# EAGLE design Liion-Tester (EAGLE 9.6.2)
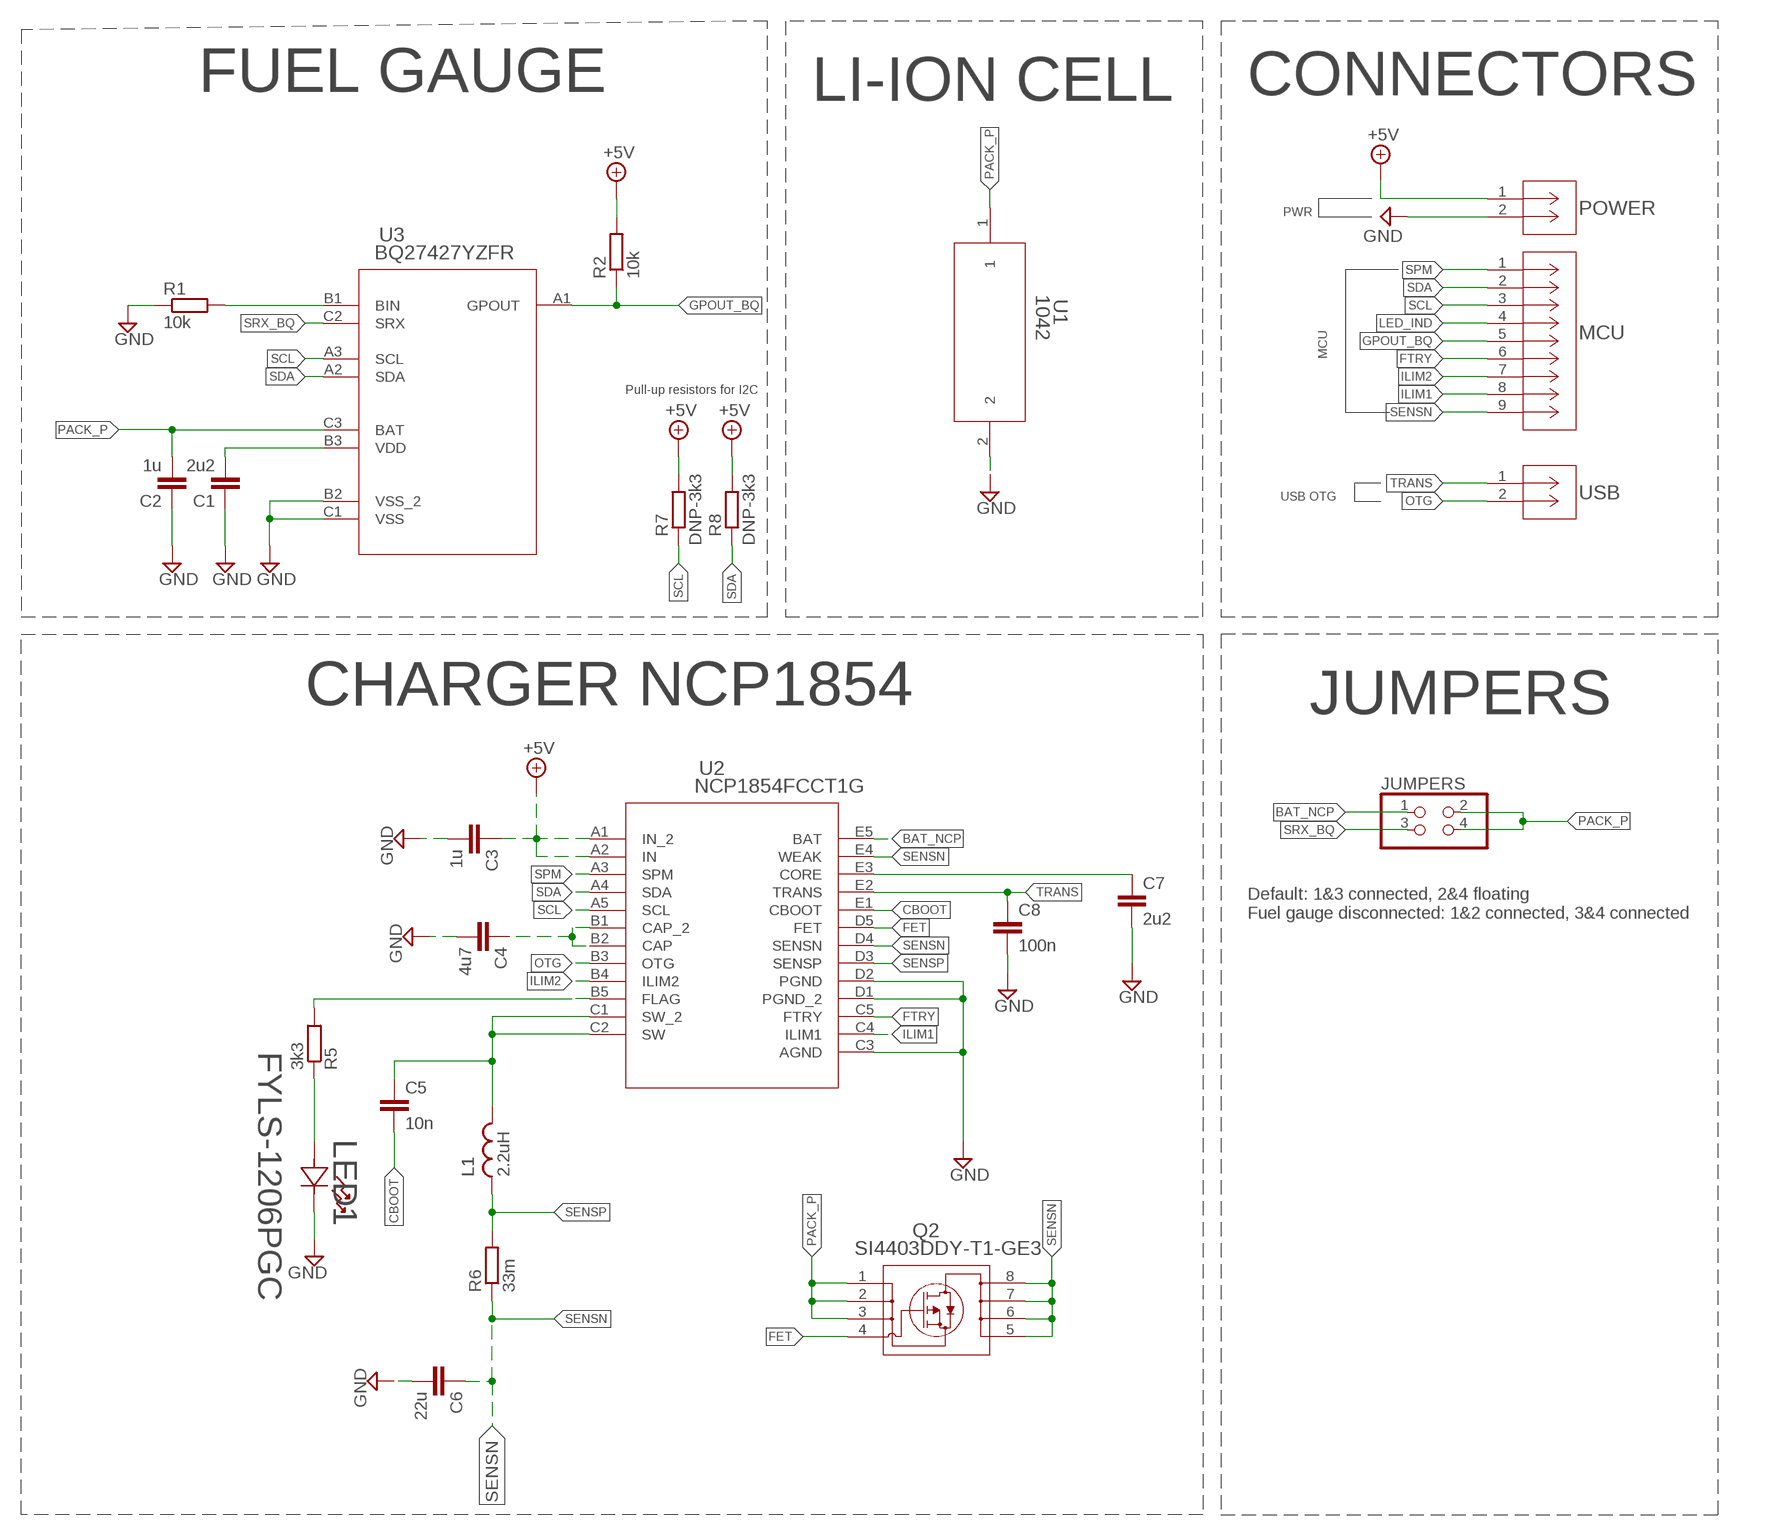
[diagram p0: schematic, sheet 1]

## Parts
C1  2u2  C-EUC0603  [C0603]
C2  1u  C-EUC0603  [C0603]
C3  1u  C-EUC0603  [C0603]
C4  4u7  C-EUC0603  [C0603]
C5  10n  C-EUC0603  [C0603]
C6  22u  C-EUC0603  [C0603]
C7  2u2  C-EUC0603  [C0603]
C8  100n  C-EUC0603  [C0603]
JUMPERS  PINHD-2X2  [2X02]
L1  2.2uH  SPM3012T-2R2M-LR  [SPM3012T-2R2M-LR]
LED1  FYLS-1206PGC  QBLP650-IW  [LED_QBLP650_1206_QTB]
MCU  250-109  [CONN_250-109_WAG]
POWER  250-102  [CONN_250-102_WAG]
Q2  SI4403DDY-T1-GE3  [SO-8_MS-012_VIS]
R1  10k  R-EU_R0603  [R0603]
R2  10k  R-EU_R0603  [R0603]
R5  3k3  R-EU_R0603  [R0603]
R6  33m  R-EU_R2512  [R2512]
R7  DNP-3k3  R-EU_R0603  [R0603]
R8  DNP-3k3  R-EU_R0603  [R0603]
U1  1042  [1042_KEY]
U2  NCP1854FCCT1G  [BGA25_2P55X2P2_ONS]
U3  BQ27427YZFR  [DSBGA9-YZF_TEX]
USB  250-102  [CONN_250-102_WAG]

## Nets
+5V: C3.1 POWER.1 R2.2 R7.2 R8.2 U2.A1(IN_2) U2.A2(IN)
BAT_NCP: JUMPERS.1 U2.E5(BAT)
CBOOT: C5.2 U2.E1(CBOOT)
FET: Q2.4 U2.D5(FET)
FTRY: MCU.6 U2.C5(FTRY)
GND: C1.1 C2.1 C3.2 C4.2 C6.2 C7.2 C8.2 LED1.1(CATHODE) POWER.2 R1.1 U1.2 U2.C3(AGND) U2.D1(PGND_2) U2.D2(PGND) U3.B2(VSS_2) U3.C1(VSS)
GPOUT_BQ: MCU.5 R2.1 U3.A1(GPOUT)
ILIM1: MCU.8 U2.C4(ILIM1)
ILIM2: MCU.7 U2.B4(ILIM2)
LED_IND: MCU.4 R5.2 U2.B5(FLAG)
N$1: C1.2 U3.B3(VDD)
N$2: R1.2 U3.B1(BIN)
N$3: C4.1 U2.B1(CAP_2) U2.B2(CAP)
N$4: LED1.2(ANODE) R5.1
N$7: C5.1 L1.P$2 U2.C1(SW_2) U2.C2(SW)
N$8: C7.1 U2.E3(CORE)
OTG: U2.B3(OTG) USB.2
PACK_P: C2.2 JUMPERS.2 JUMPERS.4 Q2.1 Q2.2 Q2.3 U1.1 U3.C3(BAT)
SCL: MCU.3 R7.1 U2.A5(SCL) U3.A3(SCL)
SDA: MCU.2 R8.1 U2.A4(SDA) U3.A2(SDA)
SENSN: C6.1 MCU.9 Q2.5 Q2.6 Q2.7 Q2.8 R6.1 U2.D4(SENSN) U2.E4(WEAK)
SENSP: L1.P$1 R6.2 U2.D3(SENSP)
SPM: MCU.1 U2.A3(SPM)
SRX_BQ: JUMPERS.3 U3.C2(SRX)
TRANS: C8.1 U2.E2(TRANS) USB.1

## Notes on the sheet
- FUEL GAUGE | LI-ION CELL
- CONNECTORS
- PWR
- MCU
- Pull-up resistors for I2C
- USB OTG
- CHARGER NCP1854 | JUMPERS
- Default: 1&3 connected, 2&4 floating
  Fuel gauge disconnected: 1&2 connected, 3&4 connected

## Library data of the parts
C1-C8 = rcl:C-EU: CAPACITOR, European symbol; SPICEPREFIX: C
JUMPERS = pinhead:PINHD-2X2: PIN HEADER
L1 = custom_library:SPM3012T-2R2M-LR
LED1 = custom_library:QBLP650-IW; COPYRIGHT: Copyright (C) 2024 Ultra Librarian. All rights reserved.; MANUFACTURER_PART_NUMBER: QBLP650-IW; MFR_NAME: QT Brightek; TYPE: LED Indication
MCU = custom_library:250-109; COPYRIGHT: Copyright (C) 2024 Ultra Librarian. All rights reserved.; MANUFACTURER_PART_NUMBER: 250-109; MFR_NAME: Wago
POWER USB = custom_library:250-102; COPYRIGHT: Copyright (C) 2024 Ultra Librarian. All rights reserved.; MANUFACTURER_PART_NUMBER: 250-102; MFR_NAME: Wago
Q2 = custom_library:SI4403DDY-T1-GE3; COPYRIGHT: Copyright (C) 2024 Ultra Librarian. All rights reserved.; MANUFACTURER_PART_NUMBER: SI4403DDY-T1-GE3; MFR_NAME: Vishay; TYPE: Transistors
R1 R2 R5-R8 = rcl:R-EU_: RESISTOR, European symbol; SPICEPREFIX: R
U1 = custom_library:1042; COPYRIGHT: Copyright (C) 2024 Ultra Librarian. All rights reserved.; MANUFACTURER_PART_NUMBER: 1042; MFR_NAME: Keystone Electronics
U2 = custom_library:NCP1854FCCT1G; COPYRIGHT: Copyright (C) 2024 Ultra Librarian. All rights reserved.; MANUFACTURER_PART_NUMBER: NCP1854FCCT1G; MFR_NAME: onsemi
U3 = custom_library:BQ27427YZFR; COPYRIGHT: Copyright (C) 2024 Ultra Librarian. All rights reserved.; MANUFACTURER_PART_NUMBER: BQ27427YZFR; MFR_NAME: Texas Instruments

## Board
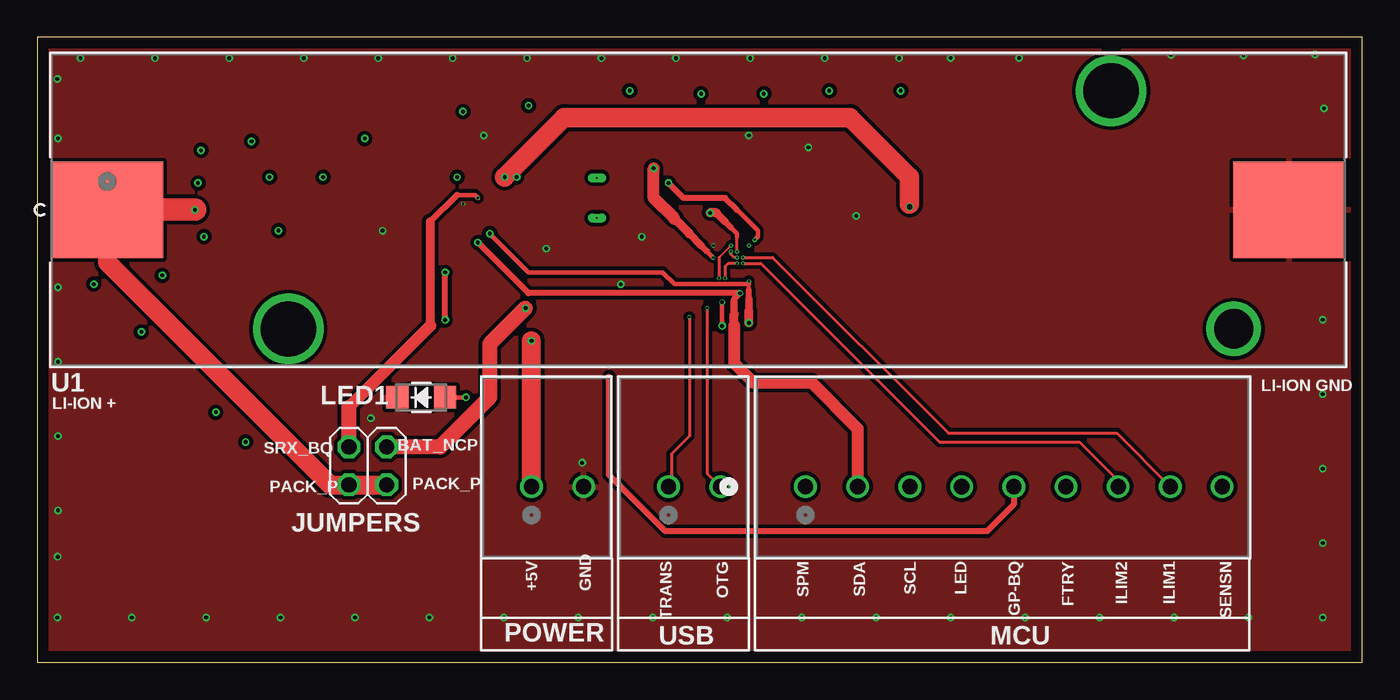
[diagram p1: board, top side]
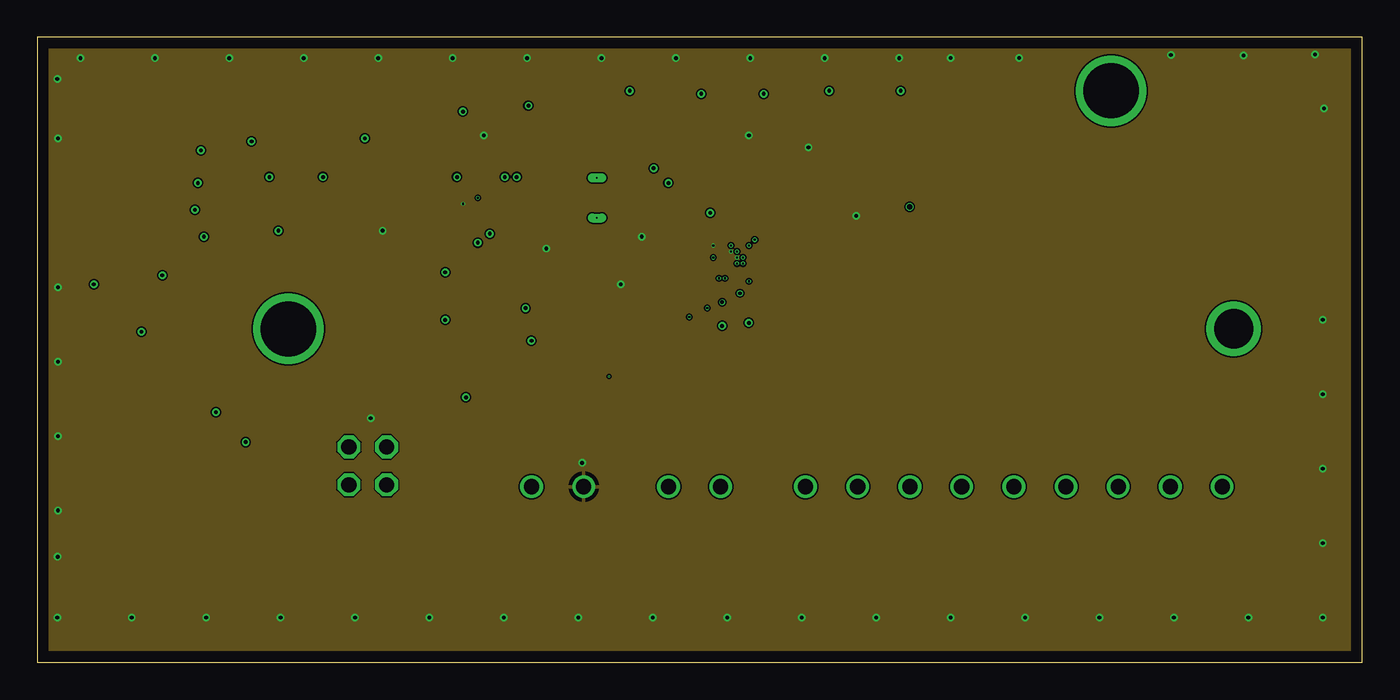
[diagram p2: board, inner layer Route2]
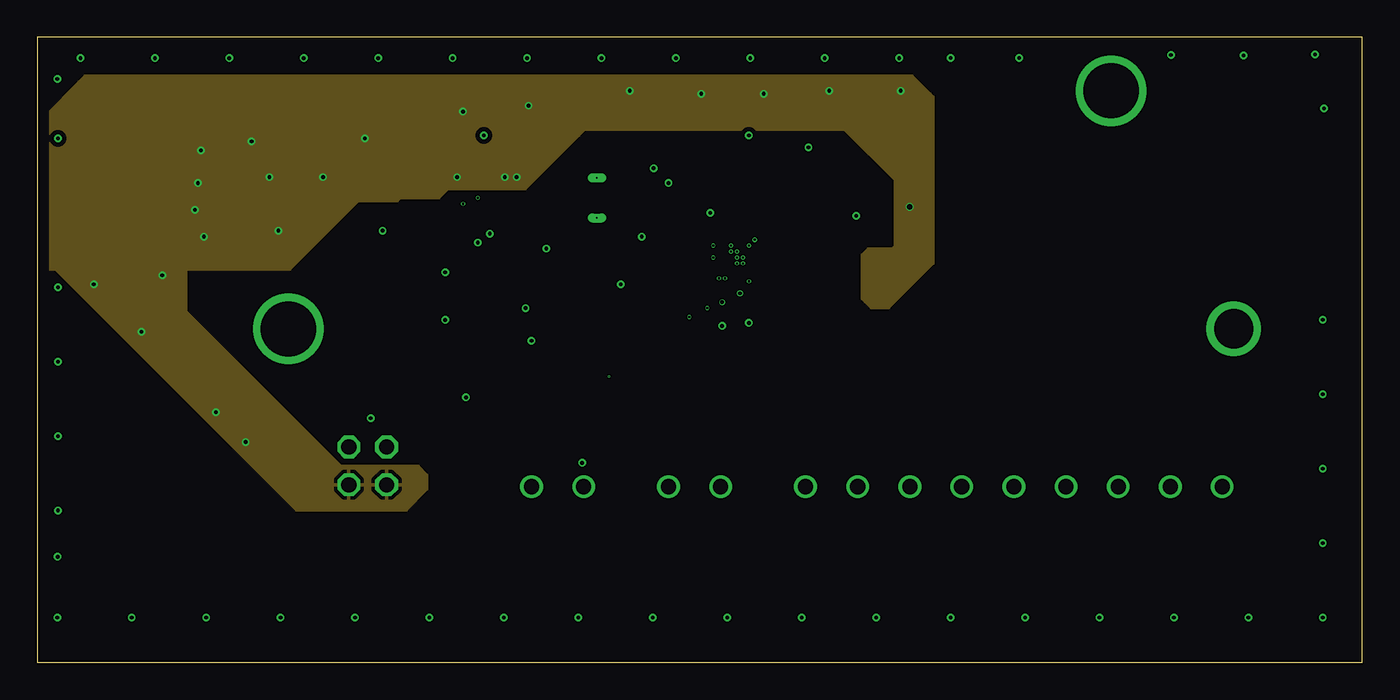
[diagram p3: board, inner layer Route15]
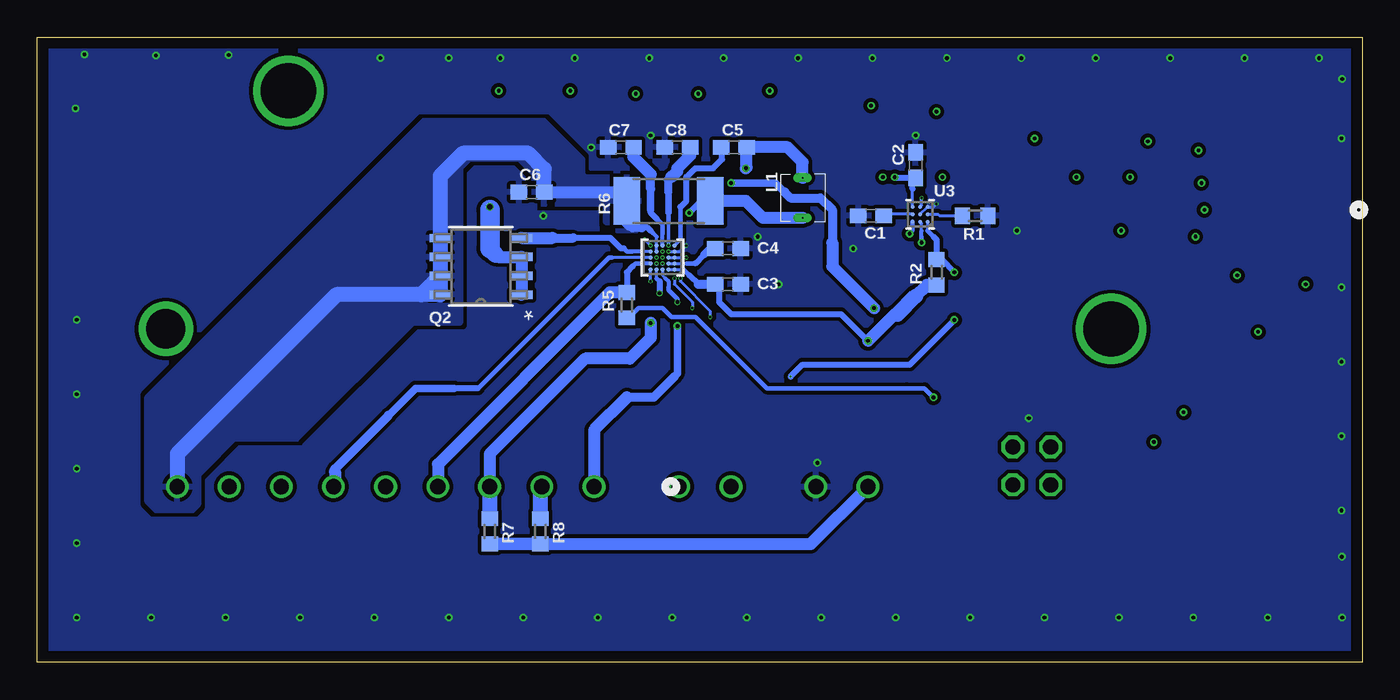
[diagram p4: board, bottom side, seen from below]

Size 89 x 42 mm. Coordinates in mm from the lower left corner, seen from the top.
Outline: 0,0 89,0 89,42 0,42 0,0
Copper layers (1+2*15+16): Top 0.035mm / dielectric 1.5mm / Route2 0.035mm / dielectric 0.15mm / Route15 0.035mm / dielectric 0.2mm / Bottom 0.035mm
Design rules "default *": minimum track width 4mil, minimum drill 0.04mm, track to track 4mil, track to pad 4mil, pad to pad 3mil, via to via 3mil, smd to smd 4mil, copper to edge 30mil, drill to drill 3mil, minimum pad ring 10mil, minimum via ring 2mil, stop-mask expansion 4mil, vias tented up to drill 250mil, thermal gap 10mil

### Footprints (pad centres in the part's own frame; a part is rotated, then mirrored left to right if it is on the bottom)
C0603 = smd 1.1 x 1: 1 -0.85,0; 2 0.85,0
2X02 = drill 1.016 octagon: 1 -1.27,-1.27; 2 -1.27,1.27; 3 1.27,-1.27; 4 1.27,1.27
SPM3012T-2R2M-LR = drill 0.1 long: P$1 -1.35,0; P$2 1.35,0
LED_QBLP650_1206_QTB = smd 1.5 x 1.499: 1 -1.6,0; 2 1.6,0
CONN_250-109_WAG = drill 1.016 pad 1.524: 1 0,0; 2 3.505,0; 3 7.01,0; 4 10.49,0; 5 13.995,0; 6 17.501,0; 7 21.006,0; 8 24.511,0; 9 27.991,0
CONN_250-102_WAG = drill 1.016 pad 1.524: 1 0,0; 2 3.505,0
SO-8_MS-012_VIS = smd 1.46 x 0.559: 1 -2.724,1.905; 2 -2.724,0.635; 3 -2.724,-0.635; 4 -2.724,-1.905; 5 2.724,-1.905; 6 2.724,-0.635; 7 2.724,0.635; 8 2.724,1.905
R0603 = smd 1 x 1.1: 1 -0.85,0; 2 0.85,0
R2512 = smd 1.8 x 3.2: 1 -2.8,0; 2 2.8,0
1042_KEY = smd 7.468 x 6.477: 1 -39.688,0; 2 39.688,0 | drill 3.708 pad 3.708: 3 27.737,8.001; 5 -27.534,-8.001 | drill 2.642 pad 2.642: 4 35.966,-8.001
BGA25_2P55X2P2_ONS = smd 0.305 x 0.305: A1 -0.8,0.8; A2 -0.4,0.8; A3 0,0.8; A4 0.4,0.8; A5 0.8,0.8; B1 -0.8,0.4; B2 -0.4,0.4; B3 0,0.4; B4 0.4,0.4; B5 0.8,0.4; C1 -0.8,0; C2 -0.4,0; C3 0,0; C4 0.4,0; C5 0.8,0; D1 -0.8,-0.4; D2 -0.4,-0.4; D3 0,-0.4; D4 0.4,-0.4; D5 0.8,-0.4; E1 -0.8,-0.8; E2 -0.4,-0.8; E3 0,-0.8; E4 0.4,-0.8; E5 0.8,-0.8
DSBGA9-YZF_TEX = smd 0.284 x 0.284: A1 -0.5,0.5; A2 0,0.5; A3 0.5,0.5; B1 -0.5,0; B2 0,0; B3 0.5,0; C1 -0.5,-0.5; C2 0,-0.5; C3 0.5,-0.5

### Placement (x,y rotation side)
C1  33,30 0 bottom
C2  30,33.4 270 bottom
C3  42.6,25.4 0 bottom
C4  42.6,27.8 0 bottom
C5  42.2,34.6 180 bottom
C6  55.8,31.6 180 bottom
C7  49.8,34.6 180 bottom
C8  46,34.6 180 bottom
JUMPERS  22.2,13.2 180 top
L1  37.6,31.2 90 bottom
LED1  25.8,17.8 0 top
MCU  51.6,11.8 0 top
POWER  33.2,11.8 0 top
Q2  59.2,26.6 180 bottom
R1  26,30 180 bottom
R2  28.6,26.2 270 bottom
R5  49.4,24 90 bottom
R6  46.6,31 0 bottom
R7  58.6,8.8 270 bottom
R8  55.2,8.8 270 bottom
U1  44.4,30.4 0 top
U2  47,27.2 180 bottom
U3  29.7,30.1 180 bottom
USB  42.4,11.8 0 top

### Tracks (layer width: path | path; a pad name or v marks a point on that pad's centre or on a via)
+5V  (via drill 0.25 pad 0.5)
  Top 1.27: POWER.1 v33.2,21.6
  Bottom 0.203: U2.A2 U2.A1 45.6,26.4
  Bottom 0.305: 45.6,26.4 45.2,26
  Bottom 0.4: C3.1 43.2,25.15 43.2,24.2 42.4,23.4 35,23.4 v33.2,21.6
  Bottom 0.406: 45.2,26 44.6,25.4
  Bottom 0.61: 44.6,25.4 C3.1
  Bottom 0.8: v33.2,21.6 31.4,23.4 31.2,23.4
  Bottom 0.813: 30,24.6 29.25,25.35 R2.2 | R8.2 R7.2 37.05,7.95 POWER.1
  Bottom 1.016: 31.2,23.4 30,24.6
BAT_NCP  (via drill 0.15 pad 0.25, 0.15 pad 0.3, 0.25 pad 0.5)
  Top 0.305: v48.2,28.4 48.4,28.6 48.4,29 47,30.4
  Top 0.406: 47,30.4 46.2,31.2 43.4,31.2 v42.4,32.2
  Top 1: v32.8,23.8 30.4,21.4 30.4,17.8 27.07,14.47 JUMPERS.1
  Bottom 0.2: U2.E5 v48.2,28.4
  Bottom 0.508: v42.4,32.2 39.4,32.2 38.8,31.6
  Bottom 0.6: 38.8,31.6 38.4,31.2 36.4,31.2 35.6,30.4 35.6,28.2
  Bottom 0.8: 35.6,28.2 35.6,26.6 v32.8,23.8
  other vias: 47.8,28
CBOOT
  Bottom 0.25: U2.E1 45.8,28.4
  Bottom 0.3: 45.8,28.4 45.8,30.6
  Bottom 0.4: 45.8,30.6 45.4,31 45.4,32.6 44.8,33.2 43.6,33.2 43,33.8 43,34.55 C5.2
FET
  Bottom 0.2: U2.D5 48.4,27.6
  Bottom 0.254: 48.4,27.6 49,27.6
  Bottom 0.305: 49,27.6 49.4,27.6 49.6,27.8
  Bottom 0.406: 54.4,28.5 54.2,28.5 | 53,28.5 50.51,28.5 49.8,27.8 49.6,27.8
  Bottom 0.61: 54.2,28.5 53,28.5
  Bottom 0.813: Q2.4 54.4,28.5
FTRY
  Bottom 0.203: U2.C5 50.4,27.2
  Bottom 0.3: 50.4,27.2 50.6,27.2 59.4,18.4
  Bottom 0.4: 59.4,18.4 61,18.4
  Bottom 0.508: 61,18.4 63.6,18.4 65.4,16.6
  Bottom 0.61: 65.4,16.6 69,13 69,12.8
  Bottom 0.813: 69,12.8 69,11.9 MCU.6
GND  (via drill 0.15, 0.15 pad 0.25, 0.25 pad 0.5)
  Top 0.2: U2.C3 46.8,27.2 46.6,27.4 U2.D2
  Bottom 0.2: U2.D2 U2.D1 45.8,27.6 v45.4,28
  Bottom 0.203: v28.6,30.8 28.8,30.6 U3.C1 U3.B2
  other vias: 40.6,28.6 39.2,25.4 30,35.4 47,27.2 46.6,27.6 51.8,34.6 55,30 36.6,13.4 22.4,16.4 86.43,37.22 34.2,27.8 23.2,29 47.8,35.4 1.4,15.2 1.4,10.2 1.37,7.09 1.35,3.01 6.35,3.01 11.35,3.01 21.35,3.01 16.35,3.01 26.35,3.01 31.35,3.01 36.35,3.01 41.35,3.01 46.35,3.01 51.35,3.01 56.35,3.01 61.35,3.01 66.35,3.01 71.35,3.01 76.35,3.01 81.35,3.01 86.35,3.01 86.35,8.01 86.35,13.01 86.35,18.01 86.35,23.01 85.82,40.84 81.02,40.78 76.15,40.81 65.95,40.61 61.35,40.61 57.9,40.59 52.9,40.59 47.9,40.59 42.9,40.59 37.9,40.59 32.9,40.59 27.9,40.59 22.9,40.59 17.9,40.59 12.9,40.59 7.9,40.59 2.9,40.59 1.4,20.2 1.4,25.2 1.4,35.2 1.35,39.2
  pour Top (isolate 0.254, rank 2): -0.8,42.6 90,42.6 90,-1.07 90.13,-1.2 -0.8,-1.2
  pour Bottom (isolate 0.254, rank 2): -1.8,44 91.2,44 91.2,-2 -1.8,-2
  pour Route2: -4.4,47.6 94,47.6 94,-4.4 -4.6,-4.4 -4.6,47.6
GPOUT_BQ  (via drill 0.05, 0.25 pad 0.5)
  Top 0.4: MCU.5 65.59,10.59 63.8,8.8 42.2,8.8 38.4,12.6 v38.4,19.2 | v27.4,23 v27.4,26.2
  Bottom 0.2: U3.A1 | U3.A1 29.2,29
  Bottom 0.305: 29.2,29 28.8,28.6
  Bottom 0.4: v38.4,19.2 37.6,20 30.4,20 v27.4,23 | v27.4,26.2 28.25,27.05 R2.1
  Bottom 0.406: 28.8,28.6 28.6,28.4 R2.1
ILIM1  (via drill 0.15 pad 0.25)
  Top 0.203: U2.C4 49.4,27.2 61.2,15.4 72.51,15.4 MCU.8
  other vias: 47.4,27.2
ILIM2  (via drill 0.15 pad 0.25)
  Top 0.203: U2.B4 48.6,26.8 60.6,14.8 70,14.8 72.61,12.19 MCU.7
  other vias: 47.4,26.8
LED_IND
  Bottom 0.254: U2.B5 48.4,26.8
  Bottom 0.305: 48.4,26.8 48.8,26.8 49,26.6
  Bottom 0.406: 49,26.6 49.4,26.2 R5.2
  Bottom 0.813: R5.2 50.55,24.85 62.09,13.31 MCU.4
N$1
  Bottom 0.203: U3.B3 32.05,30.1 C1.2
N$2
  Bottom 0.203: U3.B1 28.5,30.1 28.4,30 R1.2
N$3
  Bottom 0.2: U2.B2 U2.B1 45.4,26.8
  Bottom 0.305: 45.4,26.8 44.8,26.8
  Bottom 0.406: 44.8,26.8 44.2,27.4
  Bottom 0.508: 44.2,27.4 43.8,27.8 C4.1
N$4  (via drill 0.25 pad 0.5)
  Top 0.305: v28.8,17.8 LED1.2
  Bottom 0.3: 49.25,23.15 48.6,23.8 47,23.8 46.4,23.2 44.8,23.2 40,18.4 30.6,18.4
  Bottom 0.305: 30.6,18.4 29.4,18.4 v28.8,17.8
  Bottom 0.813: R5.1 49.25,23.15
N$7  (via drill 0.15, 0.25 pad 0.5)
  Top 0.305: v45.4,27.2 45,27.6
  Top 0.406: 45,27.6 44.6,28
  Top 0.508: 44.6,28 43.8,28.8
  Top 0.61: 43.8,28.8 42.8,29.8
  Top 0.813: 42.8,29.8 41.4,31.2 v41.4,33.2
  Bottom 0.203: U2.C2 U2.C1 v45.4,27.2
  Bottom 0.813: L1.P$2 37.6,33.6 38.6,34.6 C5.1 41.35,33.25 v41.4,33.2
N$8
  Bottom 0.254: U2.E3 47,28.8
  Bottom 0.305: 47,28.8 47,29.4 47.4,29.8
  Bottom 0.406: 47.4,29.8 47.8,30.2 47.8,30.4
  Bottom 0.508: 47.8,30.4 47.8,31.8
  Bottom 0.61: 47.8,31.8 47.8,32.8
  Bottom 0.813: C7.1 48.95,33.95 47.8,32.8
OTG  (via drill 0.15, 0.15 pad 0.25)
  Top 0.2: U2.B3 46.4,26.8 46.2,26.6 v46.2,25.8 | v45,23.8 45,12.7 USB.2
  Bottom 0.2: v46.2,25.8 46.2,25.4 45,24.2 v45,23.8
  other vias: 47,26.8
PACK_P  (via drill 0.25 pad 0.5, 0.35)
  Top 0.152: 58.6,30.8 v58.6,30.6
  Top 1.27: U1.1 4.71,26.89 19.67,11.93 JUMPERS.4 JUMPERS.2
  Top 1.3: v31.4,32.6 35.4,36.6 54.6,36.6 58.6,32.6 58.6,30.8
  Top 1.5: v10.6,30.4 U1.1
  Bottom 0.152: v58.6,30.6 58.6,30.4
  Bottom 0.2: Q2.2 Q2.1
  Bottom 0.203: U3.C3 30.2,31.8
  Bottom 0.406: 30.2,31.8 30.2,32.35 C2.2 31.35,32.55 v31.4,32.6
  Bottom 0.813: 58.2,27.4 58.03,27.23 Q2.3 Q2.1
  Bottom 1.1: 58.2,27.4 58.6,27.8
  Bottom 1.3: 58.6,30.4 58.6,27.8
  other vias: 10.8,32.2 11.2,28.6 11,34.4 28.2,32.6 32.2,32.6 14,14.8 12,16.8 7,22.2 3.8,25.4 8.4,26 14.4,35 15.6,32.6 22,35.2 16.2,29 19.2,32.6 28.6,37 33,37.4 39.8,38.4 44.6,38.2 48.8,38.2 53.2,38.4 58,38.4
  pour Route15 (isolate 0.305): 0.6,34 0.6,26.6 0.8,26.4 16.8,26.4 21.4,31 24.2,31 24.4,31.2 27,31.2 27.6,31.8 32.8,31.8 36.4,35.4 36.8,35.8 54.2,35.8 57.6,32.4 57.6,28 57.4,27.8 55.8,27.8 55.4,27.4 55.4,24.4 55.6,24.2 56,23.8 57.2,23.8 60.2,26.8 60.2,34 60.2,38 60,38.2 58.8,39.4 17.2,39.4 3.2,39.4 2.8,39 0.6,36.8
  pour Route15 (isolate 0.305): 10,27.8 10,34 9.6,34.4 1.2,34.4 0.6,33.8 0.6,33.2 0.6,27 1.2,26.4 17.4,10.2 24.8,10.2 26.2,11.6 26.2,12.4 26.2,12.6 25.6,13.2 20.4,13.2 10,23.6
  pour Route15 (isolate 0.305): 10,33.4 10,27.8 11.4,26.4 17,26.4 21.6,31 24.2,31 24.4,31.2 24.6,31.2 27,31.2 27.6,31.8 32.8,31.8 32.8,33.2 28.6,33.2 27,34.8 25.2,36.6 15.2,36.6 10.2,36.6 10,36.4
SCL  (via drill 0.15, 0.25 pad 0.5)
  Top 0.254: 47.8,25 47.8,25.4 v47.8,25.6
  Top 0.3: 47.8,25.4 42.8,25.4 42,26.2 33,26.2 v30.4,28.8
  Top 0.406: 47.8,24.4 47.8,25
  Top 0.508: 47.8,23.6 47.8,24.4
  Top 0.61: v47.8,22.8 47.8,23.6
  Bottom 0.203: v47.8,25.6 U2.A5
  Bottom 0.3: v30.4,28.8 30.2,29 U3.A3
  Bottom 0.813: v47.8,22.8 47.8,21.8 49.2,20.4 52.2,20.4 58.61,13.99 MCU.3
  Bottom 1: R7.1 MCU.3
SDA  (via drill 0.25, 0.25 pad 0.5)
  Top 0.406: 46.8,24.2 46.8,24.4 v47.2,24.8 33,24.8 v29.6,28.2
  Top 0.508: 46.8,23.4 46.8,24.2
  Top 0.61: 46.8,22.6 46.8,23.4
  Top 0.813: 46.8,22.6 46.8,20.1 48.1,18.8 52,18.8 55.11,15.7 MCU.2
  Bottom 0.2: 47.4,25.8 U2.A4
  Bottom 0.203: 29.6,29 29.6,29.5 U3.A2
  Bottom 0.254: 29.6,28.6 29.6,29
  Bottom 0.3: 47.4,25.8 47.2,25.6
  Bottom 0.305: v29.6,28.2 29.6,28.6
  Bottom 0.4: 47.2,25.6 v47.2,24.8
  Bottom 1: R8.1 55.2,11.7 MCU.2
SENSN
  Bottom 0.203: U2.D4 U2.E4 47.4,28.6
  Bottom 0.254: 47.4,28.6 47.6,28.8
  Bottom 0.305: 47.6,28.8 47.8,29
  Bottom 0.406: 47.8,29 48,29.2 48.4,29.2 | Q2.6 61.92,25.8
  Bottom 0.61: 48.4,29.2 49,29.2 49.2,29.4
  Bottom 0.813: 49.2,29.4 49.4,29.6 R6.1 50,31.6 C6.1
  Bottom 1: 60.4,34.2 61.92,32.68 Q2.5 61.92,25.8 Q2.8 63.19,24.7 | 63.19,24.7 68.91,24.7 79.59,14.01 MCU.9 | Q2.7 63.19,24.7
  Bottom 1.016: C6.1 54.95,33.15 56,34.2 60.4,34.2
  pour Bottom (isolate 0.305): 51,32.6 49,32.6 48.6,32.2 48.6,29.4 48.6,29.2 48.8,29 50,29 50.2,29 50.6,29.4 50.8,29.6 50.8,30.8 55.4,30.8 55.6,31 55.6,32 55.6,32.8 56.6,33.8 60,33.8 60.6,33.2 60.6,26.2 60.6,22.8 63.8,22.8 71.6,15 75.8,15 77.8,13 78.2,12.6 78.2,10.6 78.6,10.2 81,10.2 81.6,10.8 81.6,14.4 81.6,17.8 63,36.4 56.8,36.4 55,36.4 52.8,34.2 52.4,33.8 52.4,32.8 52.2,32.6
SENSP  (via drill 0.15 pad 0.25, 0.25 pad 0.5)
  Top 0.203: U2.D3 47,28.6
  Top 0.305: 47,28.6 47,28.8 46.6,29.2
  Top 0.406: 46.6,29.2 46.2,29.6
  Top 0.508: 46.2,29.6 45.6,30.2
  Top 0.6: 45.6,30.2 v45.2,30.2
  Bottom 0.406: v45.2,30.2 44.4,31 R6.2
  Bottom 0.8: L1.P$1 40.25,29.85 41.4,31 R6.2
  other vias: 47,27.6
SPM  (via drill 0.25, 0.25 pad 0.5)
  Top 0.305: v46,24.2 v46,22.6
  Bottom 0.2: U2.A3 47,26 46.8,25.8
  Bottom 0.254: 46.8,25.8 46.6,25.6 46.6,25.2
  Bottom 0.305: 46.6,25.2 46.6,25 46,24.4 v46,24.2
  Bottom 0.508: v46,22.6 46,19.4 46.2,19.2
  Bottom 0.61: 46.2,19.2 47.6,17.8 49.4,17.8
  Bottom 0.813: 49.4,17.8 51.6,15.6 MCU.1
SRX_BQ  (via drill 0.15)
  Top 0.3: v29.6,31.2 29.4,31.4 28.2,31.4
  Top 0.4: 28.2,31.4 26.4,29.6
  Top 0.6: 26.4,29.6 26.4,22.6
  Top 0.8: 26.4,22.6 20.93,17.13
  Top 1: 20.93,17.13 JUMPERS.3
  Bottom 0.203: U3.C2 29.6,30.7 v29.6,31.2
TRANS  (via drill 0.15, 0.15 pad 0.25)
  Top 0.11: U2.E2 45.8,27.2
  Top 0.2: 45.8,27.2 v45.8,25.8 | v43.8,23.2 43.8,15.2 42.6,14 42.6,12 USB.1
  Bottom 0.2: v45.8,25.8 45.8,25.6 43.8,23.6 v43.8,23.2
  Bottom 0.25: U2.E2 46.6,29.6
  Bottom 0.3: 46.6,29.6 46.6,30.2
  Bottom 0.45: 46.6,30.2 46.6,31.6
  Bottom 0.55: 46.6,31.6 46.6,32.4
  Bottom 0.61: 46.6,32.4 46.4,32.6
  Bottom 0.813: 46.4,32.6 46,33 46,33.2 45.15,34.05 C8.1
  other vias: 46.6,28

### Text on the board
tPlace: LI-ION GND | LI-ION + | BAT_NCP | SRX_BQ | PACK_P | PACK_P | TRANS | OTG | SPM | SDA | SCL | LED | GP-BQ | FTRY | ILIM2 | ILIM1 | SENSN | +5V | GND